# Altium schematic sheet SPITEMP3.SchDoc
size A
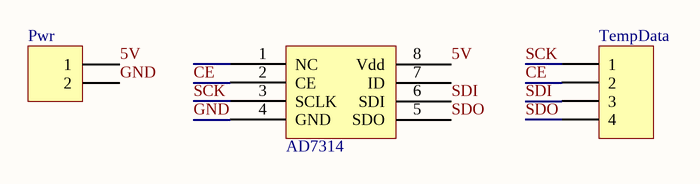
[diagram p0: SPITEMP3.SchDoc]

## Parts
AD7314  SPI Temp Sensor  [AD7314]  (value not drawn)
Pwr  (no value)  [HDR1X2]
TempData  Header for Temperature Data  [HDR1X4]  (value not drawn)

## Nets
5V: AD7314.8(Vdd) Pwr.1
CE: AD7314.2(CE) TempData.2
GND: AD7314.4(GND) Pwr.2
SCK: AD7314.3(SCLK) TempData.1
SDI: AD7314.6(SDI) TempData.3
SDO: AD7314.5(SDO) TempData.4

Not connected (* = marked no-connect by the designer): AD7314 1(NC) 7(ID)

## Library data of the parts
AD7314 = AD7314: SPI Temp Sensor (8-lead MSOP
Pwr = Header 2: Header, 2-Pin; LatestRevisionDate: 17-Jul-2002; LatestRevisionNote: Re-released for DXP Platform.; Publisher: Altium Limited
TempData = Header 4: Header, 4-Pin; LatestRevisionDate: 17-Jul-2002; LatestRevisionNote: Re-released for DXP Platform.; Publisher: Altium Limited